# EasyEDA Pro project 串口模块.epro, schematic 车载蓝牙供电串口V1
Board Name: 车载蓝牙供电串口V1; Create Date: 2025-03-12; Page Name: P1; Project Name: AAA串口模块; Schematic Name: 车载蓝牙供电串口V1; Update Date: 2025-03-29; Company: 嘉立创EDA; Page Size: A4; Version: V1.0
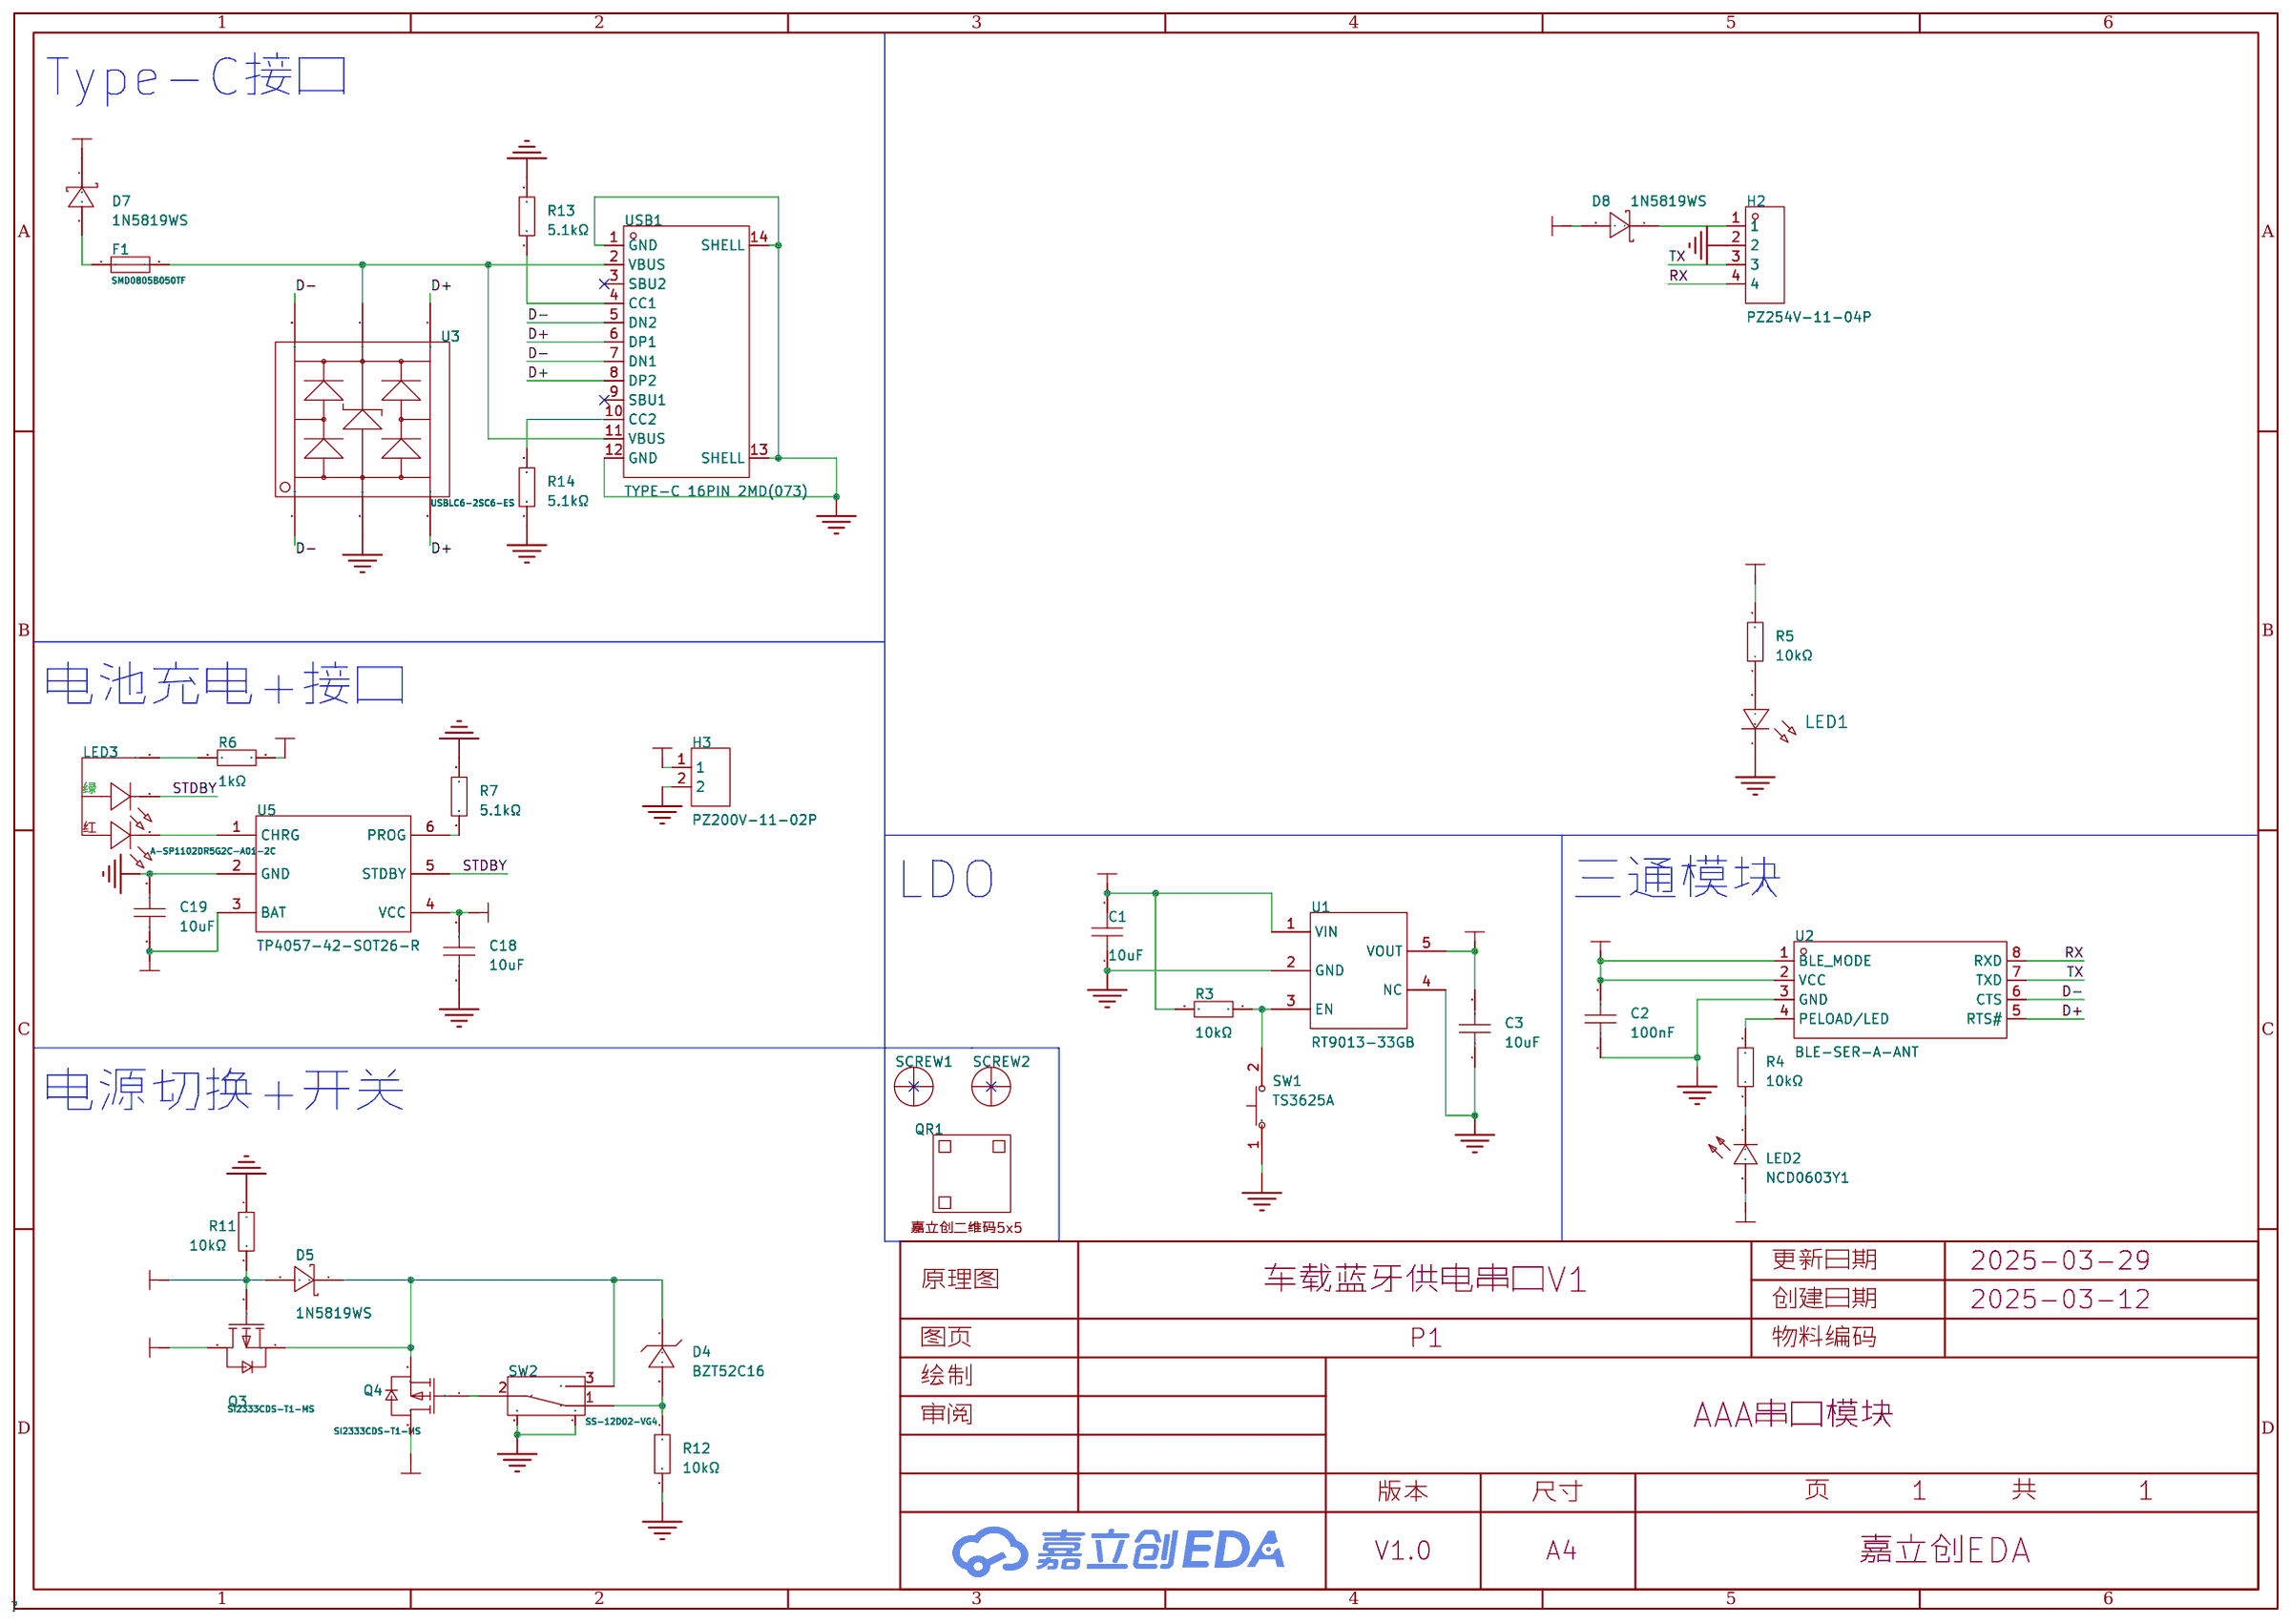
[diagram p2: schematic sheet]

## Parts
C1  10uF  [C0805]
C2  100nF  [C0603]
C3  10uF  [C0805]
C18  10uF  [C0805]
C19  10uF  [C0805]
D4  BZT52C16  [SOD-123_L2.7-W1.6-LS3.7-RD]
D5  1N5819WS  [SOD-323_L1.8-W1.3-LS2.5-RD]
D7  1N5819WS  [SOD-323_L1.8-W1.3-LS2.5-RD]
D8  1N5819WS  [SOD-323_L1.8-W1.3-LS2.5-RD]
F1  SMD0805B050TF  [F0805]
H2  PZ254V-11-04P  [HDR-TH_4P-P2.54-V-M]
H3  PZ200V-11-02P  [HDR-TH_2P-P2.00-V-M]
LED1  XL-1608SURC-06  [LED0603-RD_RED]
LED2  NCD0603Y1  [LED0603-RD]
LED3  A-SP1102DR5G2C-A01-2C  [LED-SMD_3P-L3.0-W1.5_A-SP1102DR6W1D-C01-2C]
Q3  SI2333CDS-T1-MS  [SOT-23-3_L3.0-W1.6-P1.90-LS2.8-BR]
Q4  SI2333CDS-T1-MS  [SOT-23-3_L3.0-W1.6-P1.90-LS2.8-BR]
QR1  -  [JLC-QRCODE-5x5]
R3  10kΩ  [R0603]
R4  10kΩ  [R0603]
R5  10kΩ  [R0603]
R6  1kΩ  [R0603]
R7  5.1kΩ  [R0603]
R11  10kΩ  [R0603]
R12  10kΩ  [R0603]
R13  5.1kΩ  [R0603]
R14  5.1kΩ  [R0603]
SCREW1  -  [M2螺丝]
SCREW2  -  [M2螺丝]
SW1  TS3625A  [KEY-SMD_L6.0-W3.5-LS8.4]
SW2  SS-12D02-VG4  [SW-TH_SS-12D02-VG4]
U1  RT9013-33GB  [SOT-23-5_L3.0-W1.7-P0.95-LS2.8-BL]
U2  BLE-SER-A-ANT  [WIFI-SMD_8P-P1.27_CH9140]
U3  USBLC6-2SC6-ES  [SOT-23-6_L2.9-W1.6-P0.95-LS2.8-BR]
U5  TP4057-42-SOT26-R  [SOT-23-6_L2.9-W1.6-P0.95-LS2.8-BL]
USB1  TYPE-C 16PIN 2MD(073)  [USB-C-SMD_TYPE-C-6PIN-2MD-073]

## Library data of the parts
C1 C3 C18 C19 = GRM21BR61H106KE43L: 容值:10uF;精度:±10%;额定电压:50V;材质(温度系数):X5R;; LCSC Part Name: 10uF ±10% 50V; Supplier Part: C440198; Manufacturer: muRata(村田); Supplier Footprint: 0805; JLCPCB Part Class: 基础库; Datasheet: https://atta.szlcsc.com/upload/public/pdf/source/20230811/95AAE0C9AF55EDC31B7A4D8B733F534E.pdf; Supplier: LCSC; Tolerance: ±10%; Voltage Rated: 50V; Temperature Coefficient: X5R
C2 = CC0603KRX7R9BB104: 容值:100nF;精度:±10%;额定电压:50V;材质(温度系数):X7R;; LCSC Part Name: 100nF ±10% 50V; Supplier Part: C14663; Manufacturer: YAGEO(国巨); Supplier Footprint: 0603; Datasheet: https://atta.szlcsc.com/upload/public/pdf/source/20180910/C282072_33301C7F631E79921B82A8DAC6BCC5B3.pdf; Supplier: LCSC; Tolerance: ±10%; Voltage Rated: 50V; Temperature Coefficient: X7R
D4 = BZT52C16_C216724: 二极管配置:独立式;稳压值(标称值):16V;稳压值(范围):15.3V~17.1V;功率:500mW;精度:±5%;; Supplier Part: C216724; Manufacturer: SHIKUES(时科); Supplier Footprint: SOD-123; JLCPCB Part Class: 扩展库; Datasheet: https://atta.szlcsc.com/upload/public/pdf/source/20180521/C216736_0F7817A5B0D519AB82EE72E876335F07.pdf; Supplier: LCSC; Diode Configuration: 独立式; Zener Voltage (Nom): 16V; Reverse Leakage Current (Ir): 100nA@12V; Zener Voltage (Range): 15.3V~17.1V; Power Dissipation: 500mW; Zener Impedance (Zzt): 40Ω; Tolerance: ±5%
D5 D7 D8 = 1N5819WS_C191023: 正向压降(Vf):600mV@1A;直流反向耐压(Vr):40V;整流电流:1A;; LCSC Part Name: 电压:40V 电流:1A; Supplier Part: C191023; Manufacturer: Hottech(合科泰); Supplier Footprint: SOD-323; JLCPCB Part Class: Basic Part; Datasheet: https://atta.szlcsc.com/upload/public/pdf/source/20220428/3CB86FD8D28D653594B4E35F9D5AEFD9.pdf; Supplier: LCSC; Forward Voltage (Vf@If): 600mV@1A; Reverse Voltage (Vr): 40V; Rectified Current: 1A
F1 = SMD0805B050TF: 最大电压:6V;最大电流:100A;保持电流:500mA;跳闸电流:1A;; LCSC Part Name: 6V 500mA 0805自恢复; Supplier Part: C269104; Manufacturer: Brightking(君耀电子); Supplier Footprint: 0805; JLCPCB Part Class: 扩展库; Datasheet: https://atta.szlcsc.com/upload/public/pdf/source/20180913/C269107_1BF28CF6F4C5BFD5B8CD673BC8D2B923.pdf; Supplier: LCSC; Operating Voltage (Max): 6V; Current Rating (Max): 100A; Hold Current: 500mA; Trip Current: 1A; Resistance - Initial (Ri) (Min): 150mΩ; Maximum Time to Trip: 100ms; Operating Temperature: -40℃~+85℃；-40℃~+85℃；-40℃~+85℃
H2 = PZ254V-11-04P: 插针结构:1x4P;间距:2.54mm;行距:-;圆针/方针:方针;安装类型:直插;排数:单排;总PIN位数:4P;额定电流:3A;额定电压:250V;配合针长度:6mm;塑高:2.5mm;端接针长度:3mm;触头材质:-;工作温度范围:-40℃~+105℃;颜色:黑色;; LCSC Part Name: 间距:2.54mm 1x4P 直插 方针; Supplier Part: C2691448; Manufacturer: XFCN(兴飞); Supplier Footprint: 插件,P=2.54mm; JLCPCB Part Class: 扩展库; Datasheet: https://atta.szlcsc.com/upload/public/pdf/source/20200309/C492403_F9F19131791D08044AD4F84F8E751A34.pdf; Supplier: LCSC; Pin Structure: 1x4P; Pitch: 2.54mm; Circluar Pins/Square Pins: 方针; Mounting Type: 直插; Number of Rows: 单排; Number of Pins: 4P; Current Rating (Max): 3A; Voltage Rating (Max): 250V; Length of Mating Pin: 6mm; Insulation Height: 2.5mm; Length of End Connection Pin: 3mm; Operating Temperature Range: -40℃~+105℃; Color: 黑色
H3 = PZ200V-11-02P: 插针结构:1x2P;间距:2mm;行距:-;圆针/方针:方针;安装方式:直插;排数:单排;总PIN位数:2P;额定电流:-;额定电压:-;配合针长度:3.9mm;塑高:2mm;端接针长度:2.8mm;触头材质:黄铜;触头镀层:-;工作温度:-40℃~+105℃;颜色:黑色;; LCSC Part Name: 1x2P 间距:2mm 方针 直插; Supplier Part: C541856; Manufacturer: XFCN(兴飞); Supplier Footprint: 插件,P=2mm; JLCPCB Part Class: 扩展库; Datasheet: https://atta.szlcsc.com/upload/public/pdf/source/20200518/C541858_7610F54454E936EFCDE06B655DF7C837.pdf; Supplier: LCSC; Pin Structure: 1x2P; Pitch: 2mm; Circluar Pins/Square Pins: 方针; Mounting Type: 直插; Number of Rows: 单排; Number of Pins: 2P; Length of Mating Pin: 3.9mm; Insulation Height: 2mm; Length of End Connection Pin: 2.8mm; Contact Material: 黄铜; Operating Temperature: -40℃~+105℃; Color: 黑色
LED1 = XL-1608SURC-06: 发光颜色:红色;功率:55mW;正向电流:25mA;主波长:617nm~621nm;透镜颜色:无色透明透镜;色温:-;发光角度:120°;载带方式:正贴;工作温度:-30℃~+85℃;; Supplier Part: C965799; Manufacturer: XINGLIGHT(成兴光); Supplier Footprint: 0603; JLCPCB Part Class: Extended Part; Datasheet: https://atta.szlcsc.com/upload/public/pdf/source/20221102/D860AFDD1CDB02C5A8064103A32707E2.pdf; Supplier: LCSC; Emitted Color: 红色; Power Dissipation: 55mW; Forward Current: 25mA; Dominant Wavelength: 617nm~621nm; Peak Wavelength: 623nm; Lens Color: 无色透明透镜; Viewing Angle: 120°; Mounting Sytle: 正贴; Operating Temperature: -30℃~+85℃
LED2 = NCD0603Y1: 发光颜色:黄色;正向电压(VF):1.6V~2.6V;功率:65mW;正向电流:20mA;主波长:586nm~595nm;透镜颜色:无色透明透镜;发光强度:80mcd~220mcd;发光角度:130°;工作温度:-30℃~+85℃;; Supplier Part: C84268; Manufacturer: 国星光电; Supplier Footprint: 0603; Datasheet: https://atta.szlcsc.com/upload/public/pdf/source/20200820/C84268_8FC106CB292CF978F9CFC6892464F83C.pdf; Supplier: LCSC; Emitted Color: 黄色; Forward Voltage (VF): 1.6V~2.6V; Power Dissipation: 65mW; Forward Current: 20mA; Dominant Wavelength: 586nm~595nm; Lens Color: 无色透明透镜; Luminous Intensity: 80mcd~220mcd; Viewing Angle: 130°; Operating Temperature: -30℃~+85℃
LED3 = A-SP1102DR5G2C-A01-2C: 发光颜色:红色,黄绿色;正向电压(VF):1.7V~2.4V;功率:60mW;主波长:631nm；568nm~575nm;透镜颜色:无色透明透镜;发光强度:45mcd~112mcd；28.5mcd~72mcd;发光角度:120°;载带方式:侧贴;工作温度:-40℃~+85℃;; LCSC Part Name: 1204红黄绿双色侧贴; Supplier Part: C19171305; Manufacturer: Amicc(欧密格光电); Supplier Footprint: SMD-3P,3x1mm; JLCPCB Part Class: 扩展库; Datasheet: https://atta.szlcsc.com/upload/public/pdf/source/20231108/7E46211C7C9270E5FEF06FE0CCECC808.pdf; Supplier: LCSC; Emitted Color: 红色,黄绿色; Forward Voltage (VF): 1.7V~2.4V; Power Dissipation: 60mW; Dominant Wavelength: 631nm；568nm~575nm; Lens Color: 无色透明透镜; Luminous Intensity: 45mcd~112mcd；28.5mcd~72mcd; Viewing Angle: 120°; Mounting Sytle: 侧贴; Operating Temperature: -40℃~+85℃
Q3 Q4 = SI2333CDS-T1-MS: 类型:1个P沟道;漏源电压(Vdss):18V;连续漏极电流(Id):7A;导通电阻(RDS(on)@Vgs,Id):22mΩ@4.5V,6.5A;功率(Pd):1W;阈值电压(Vgs(th)@Id):800mV@250uA;; LCSC Part Name: 1个P沟道 耐压:18V 电流:7A; Supplier Part: C5278008; Manufacturer: MSKSEMI(美森科); Supplier Footprint: SOT-23-3L; JLCPCB Part Class: 扩展库; Datasheet: https://atta.szlcsc.com/upload/public/pdf/source/20221121/B6558BE2CCE35E335487FA51269C3700.pdf; Supplier: LCSC; Type: 1个P沟道; Drain Source Voltage (Vdss): 18V; Continuous Drain Current (Id): 7A; Drain Source On Resistance (RDS(on)@Vgs,Id): 22mΩ@4.5V,6.5A; Power Dissipation (Pd): 1W; Gate Threshold Voltage (Vgs(th)@Id): 800mV@250uA; Total Gate Charge (Qg@Vgs): 10nC@4.5V; Input Capacitance (Ciss@Vds): 1.21nF@10V; Reverse Transfer Capacitance (Crss@Vds): 290pF@10V; Operating Temperature: -55℃~+150℃
QR1 = 嘉立创二维码5x5: Check: false
R3-R5 R11 R12 = RC0603FR-0710KL: 电阻类型:厚膜电阻;阻值:10kΩ;精度:±1%;功率:100mW;最大工作电压:75V;温度系数:±100ppm/℃;; LCSC Part Name: 厚膜电阻 10kΩ ±1% 100mW; Supplier Part: C98220; Manufacturer: YAGEO(国巨); Supplier Footprint: 0603; JLCPCB Part Class: Extended Part; Datasheet: https://atta.szlcsc.com/upload/public/pdf/source/20180927/C295883_E8D83085EA81BD7DE0B2B681138C15EE.pdf; Supplier: LCSC; Type: 厚膜电阻; Tolerance: ±1%; Power(Watts): 100mW; Overload Voltage (Max): 75V; Temperature Coefficient: ±100ppm/℃; Operating Temperature Range: -55℃~+155℃
R6 = 0603WAF1001T5E: 电阻类型:厚膜电阻;阻值:1kΩ;精度:±1%;功率:100mW;最大工作电压:75V;温度系数:±100ppm/℃;; LCSC Part Name: 1kΩ ±1% 100mW 厚膜电阻; Supplier Part: C21190; Manufacturer: UNI-ROYAL(厚声); Supplier Footprint: 0603; JLCPCB Part Class: 基础库; Datasheet: https://atta.szlcsc.com/upload/public/pdf/source/20200306/C422600_1E6D84923E4A46A82E41ADD87F860B5C.pdf; Supplier: LCSC; Type: 厚膜电阻; Tolerance: ±1%; Power(Watts): 100mW; Overload Voltage (Max): 75V; Temperature Coefficient: ±100ppm/℃; Operating Temperature Range: -55℃~+155℃
R7 R13 R14 = 0603WAF5101T5E: 电阻类型:厚膜电阻;阻值:5.1kΩ;精度:±1%;功率:100mW;最大工作电压:75V;温度系数:±100ppm/℃;; LCSC Part Name: 5.1kΩ ±1% 100mW 厚膜电阻; Supplier Part: C23186; Manufacturer: UNI-ROYAL(厚声); Supplier Footprint: 0603; JLCPCB Part Class: 基础库; Datasheet: https://atta.szlcsc.com/upload/public/pdf/source/20200306/C422600_1E6D84923E4A46A82E41ADD87F860B5C.pdf; Supplier: LCSC; Type: 厚膜电阻; Tolerance: ±1%; Power(Watts): 100mW; Overload Voltage (Max): 75V; Temperature Coefficient: ±100ppm/℃; Operating Temperature Range: -55℃~+155℃
SCREW1 SCREW2 = M2螺丝: Check: false
SW1 = TS3625A: 电路结构:单刀单掷;按钮形状:矩形按钮;开关长度:6.1mm;开关宽度:3.65mm;开关高度:2.5mm;触点电流:50mA;额定电压(DC):12V;安装方式:立贴;带灯:-;作用力:250gf;机械寿命:-;; LCSC Part Name: 6.1*3.65*2.5mm 立贴 轻触开关; Supplier Part: C398053; Manufacturer: SHOU HAN(首韩); Supplier Footprint: SMD; Datasheet: https://atta.szlcsc.com/upload/public/pdf/source/20190620/C398053_EFFFB524A3F966B1F45EE8333D1EDECC.pdf; Supplier: LCSC; Circuit: 单刀单掷; Actuator Style: 矩形按钮; Switch Length: 6.1mm; Switch Width: 3.65mm; Switch Height: 2.5mm; Contact Current: 50mA; Voltage Rating (DC): 12V; Mounting Style: 立贴; Operating Force: 250gf
SW2 = SS-12D02-VG4_C136719: 电路结构:单刀双掷;安装方式:直插;额定电流(DC):-;额定电压(DC):-;额定电流(AC):-;额定电压(AC):-;机械寿命:5千次;; LCSC Part Name: 直插双档 滑动开关; Supplier Part: C136719; Manufacturer: 韩国韩荣; Supplier Footprint: 插件; JLCPCB Part Class: 扩展库; Datasheet: https://atta.szlcsc.com/upload/public/pdf/source/20171030/C136719_15093664985151068208.pdf; Supplier: LCSC; Circuit: 单刀双掷; Actuator Style: 矩形柱状; Pin Style: PC引脚; Switch Height: 8.7mm; Mounting Style: 直插; Mechanical Life: 5千次; Operating Temperature: -25℃~+70℃
U1 = RT9013-33GB: 输出类型:固定;最大输入电压:5.5V;输出电压:3.3V;最大输出电流:500mA;电源纹波抑制比(PSRR):50dB@(10kHz);输出极性:正极;; LCSC Part Name: 输入5.5V 输出3.3V 500mA; Supplier Part: C47773; Manufacturer: RICHTEK(立锜); Supplier Footprint: SOT-23-5; JLCPCB Part Class: 扩展库; Datasheet: https://atta.szlcsc.com/upload/public/pdf/source/20150504/1457707282459.pdf; Supplier: LCSC; Output Type: 固定; Maximum Input Voltage: 5.5V; Output Voltage: 3.3V; MAX Output Current: 500mA; Power Supply Rejection Ratio (PSRR): 50dB@(10kHz); Dropout Voltage: 400mV@(500mA); standby current: 50uA; Operating Temperature: -40℃~+85℃; Output Polarity: 正极; Number of Outputs: 1
U2 = BLE-SER-A-ANT: LCSC Part Name: CH9140蓝牙转串口模块; Supplier Part: C2829462; Manufacturer: WCH(南京沁恒); Supplier Footprint: SMD,10.2x10.6mm; JLCPCB Part Class: 扩展库; Datasheet: https://atta.szlcsc.com/upload/public/pdf/source/20220415/E84741AD8F7214E5FBA61F031309F4A4.pdf; Supplier: LCSC
U3 = USBLC6-2SC6-ES: 极性:单向;反向截止电压(Vrwm):5V;最大钳位电压:15V;峰值脉冲电流(Ipp):4.5A;峰值脉冲功率(Ppp):75W;击穿电压:6V;; LCSC Part Name: 4路单向+带VBUS防护ESD静电防护器件，20kV，CJ：0.6pF；HDMI/USB/RJ45高速接口通讯防护; Supplier Part: C5180249; Manufacturer: ElecSuper(静芯微); Supplier Footprint: SOT23-6; JLCPCB Part Class: 扩展库; Datasheet: https://atta.szlcsc.com/upload/public/pdf/source/20240905/A8F5201896DEAFE87716A4B2E209A025.pdf; Supplier: LCSC; polarity: 单向; Reverse Stand-Off Voltage (Vrwm): 5V; Maximum Clamping Voltage: 15V; Peak Pulse Current (Ipp): 4.5A; Peak Pulse Power Dissipation (Ppp): 75W; Breakdown Voltage: 6V; Reverse Leakage Current (Ir): 1uA; Number of Lines: 双路; Type: ESD
U5 = TP4057-42-SOT26-R: LCSC Part Name: TP4057 1%; Supplier Part: C12044; Manufacturer: TOPPOWER(南京拓微); Supplier Footprint: SOT-23-6; JLCPCB Part Class: 扩展库; Datasheet: https://atta.szlcsc.com/upload/public/pdf/source/20140228/1457706997013.pdf; Supplier: LCSC
USB1 = TYPE-C 16PIN 2MD(073): 连接器类型:Type-C;标准:USB 3.1;公母:母;安装方式:卧贴;触点数量:16P;端口数量:1;额定电流 - 电源:5A;工作温度范围:-25℃~+85℃;; LCSC Part Name: Type-C 母 卧贴; Supplier Part: C2765186; Manufacturer: SHOU HAN(首韩); Supplier Footprint: SMD; Datasheet: https://atta.szlcsc.com/upload/public/pdf/source/20211123/39B17C16241EAC15C5E277BDA434118E.pdf; Supplier: LCSC; Connector Type: Type-C; Standard: USB 3.1; Gender: 母; Mounting Style: 卧贴; Number of Contacts: 16P; Number of Ports: 1; Current Rating - Power (Max): 5A; Operating Temperature Range: -25℃~+85℃; Rated Voltage (Max): 5V; Connect-Disconnect Life: 5千次; Core Colour: 黑色

## Nets
3V3: C2.2 C3.2 LED2.2(A) U1.5(VOUT) U2.1(BLE_MODE) U2.2(VCC)
GND: C1.1 C2.1 C3.1 C18.1 C19.2 H2.2 H3.2 LED1.1(C) R7.2 R11.1 R12.2 R13.2 R14.1 SW1.1 SW2.4 SW2.5 U1.2(GND) U1.4(NC) U2.3(GND) U3.2(GND) U5.2(GND) USB1.1(GND) USB1.12(GND) USB1.13(SHELL) USB1.14(SHELL)
VBAT: C19.1 H3.1 Q3.3(D) U5.3(BAT)
VIN: C18.2 D5.2(A) D7.1(K) Q3.1(G) R6.2 R11.2 U5.4(VCC)
D+: U2.5(RTS#) U3.3(I/O2) U3.4(I/O2) USB1.6(DP1) USB1.8(DP2)
D-: U2.6(CTS) U3.1(I/O1) U3.6(I/O1) USB1.5(DN2) USB1.7(DN1)
RX: H2.4 U2.8(RXD)
STDBY: LED3.2(-) U5.5(STDBY)
TX: H2.3 U2.7(TXD)
VCH: C1.2 D8.2(A) Q4.3(D) R3.2 R5.2 U1.1(VIN)
$1N600: R4.2 U2.4(PELOAD/LED)
$1N1806: LED1.2(A) R5.1
$1N3665: F1.2 U3.5(VCC) USB1.2(VBUS) USB1.11(VBUS)
$1N4390: LED2.1(K) R4.1
$1N10597: LED3.3(-) U5.1(CHRG)
$1N10598: LED3.1(+) R6.1
$1N10601: R7.1 U5.6(PROG)
$1N10971: Q4.1(G) SW2.2
$1N11056: R14.2 USB1.10(CC2)
$1N11061: R13.1 USB1.4(CC1)
$1N12744: D7.2(A) F1.1
$1N13173: D4.1(K) D5.1(K) Q3.2(S) Q4.2(S) SW2.3
$1N15369: R3.1 SW1.2 U1.3(EN)
$1N15531: D4.2(A) R12.1 SW2.1
$1N15757: D8.1(K) H2.1

Not connected (* = marked no-connect by the designer): SCREW1 1*; SCREW2 1*; USB1 3(SBU2)* 9(SBU1)*

## Notes on the sheet
- Type-C接口
- 电池充电+接口
- 绿
- 红
- LDO
- 三通模块
- 电源切换+开关
